# EAGLE schematic Empfangseinheit (EAGLE 8.1.1)
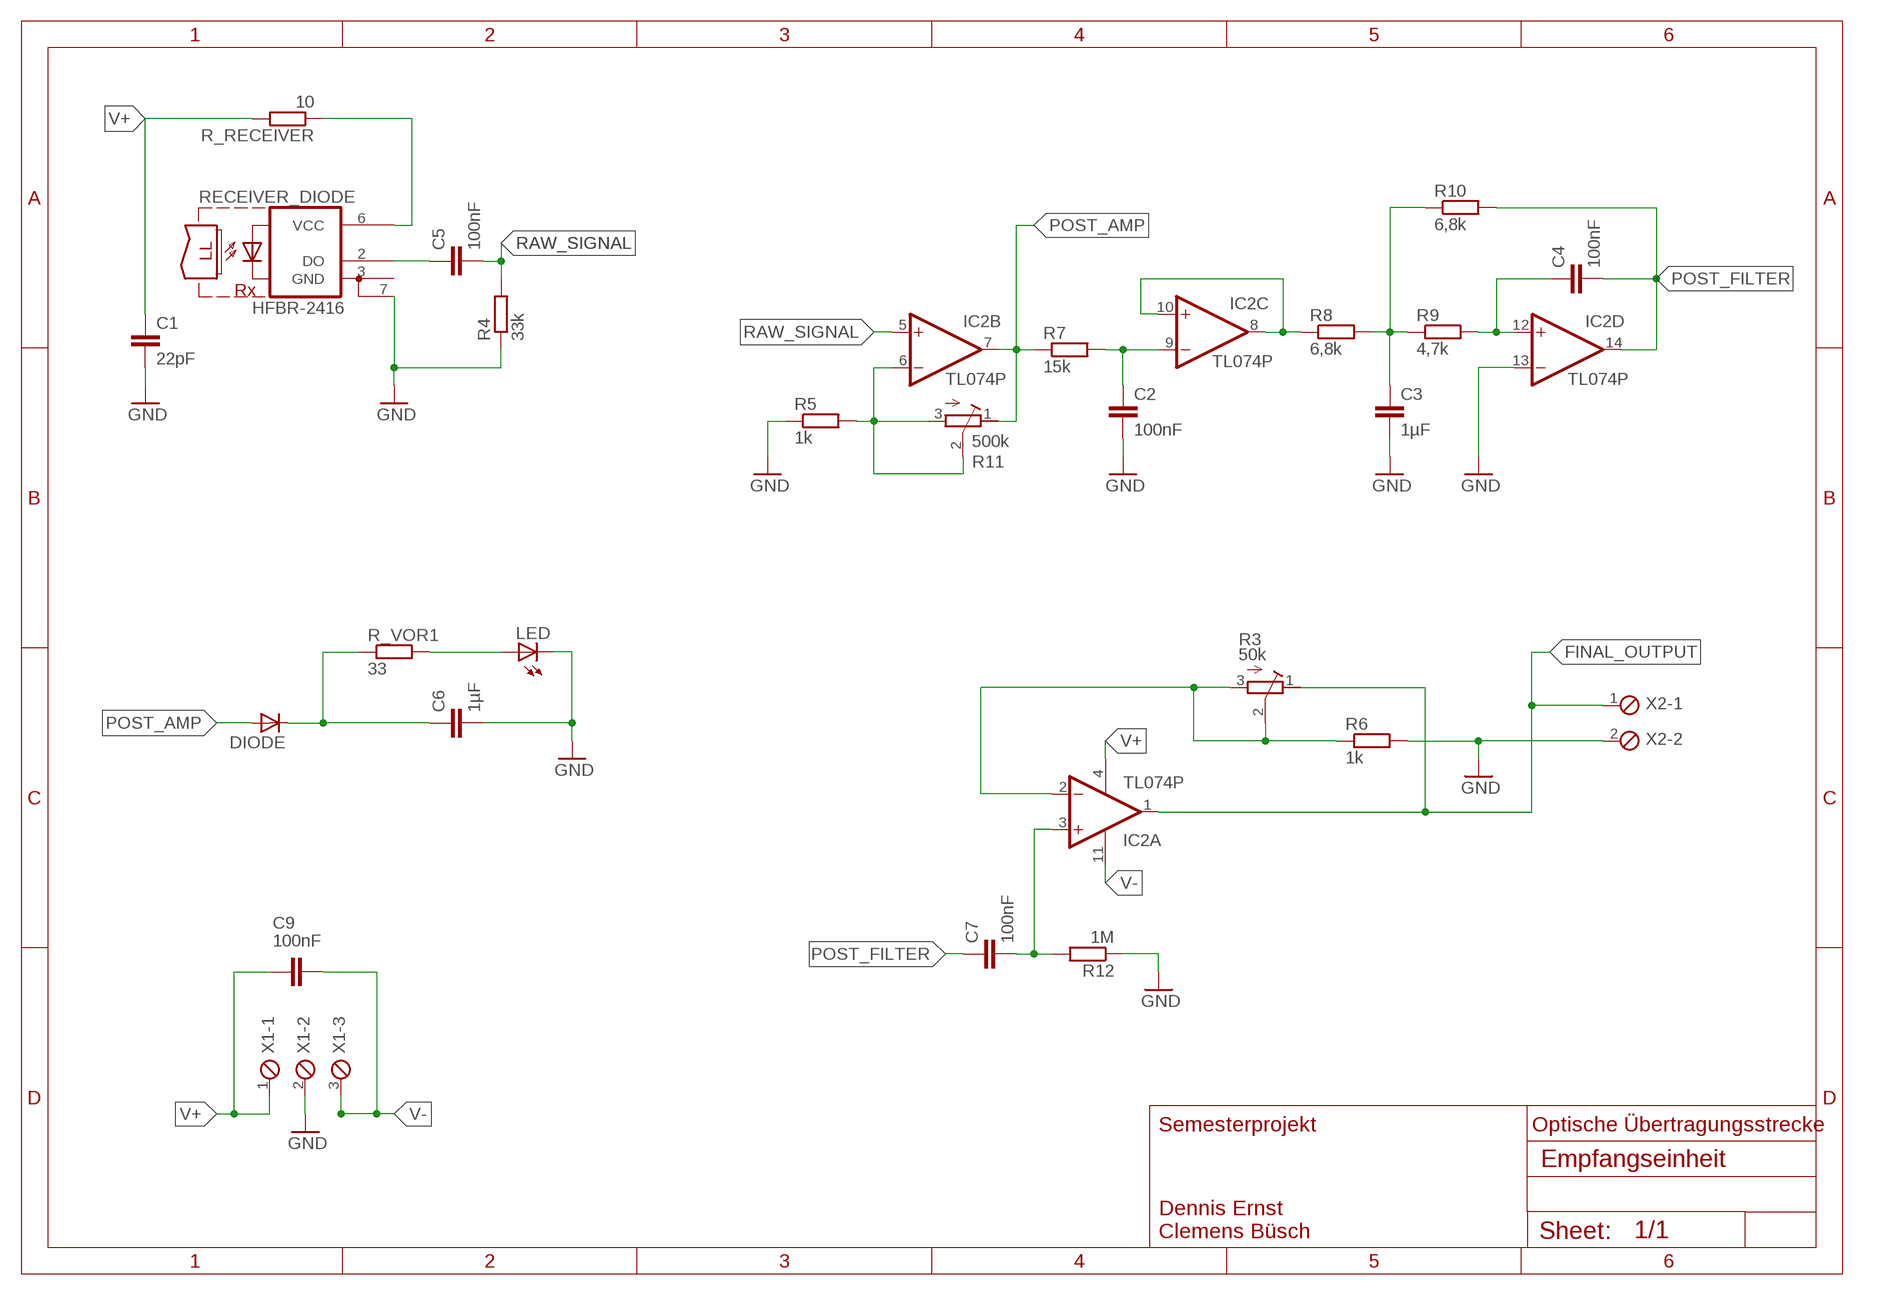
[diagram p0: schematic, sheet 1]

## Parts
C1  22pF  C-EU050-024X044  [C050-024X044]
C2  100nF  C2.5/2  [C2.5-2]
C3  1µF  C7.5/3  [C7.5B3]
C4  100nF  C2.5/2  [C2.5-2]
C5  100nF  C2.5/2  [C2.5-2]
C6  1µF  C2.5/2  [C2.5-2]
C7  100nF  C2.5/2  [C2.5-2]
C9  100nF  C2.5/2  [C2.5-2]
DIODE  DIODE_E-DO35-7  [DIODE_DO35-7]
IC2  TL074P  [DIL14]
LED  LED_ELD260  [LED_LD260]
R3  50k  R-TRIMMT93XA  [RTRIMT93XA]
R4  33k  R-EU_0207_10  [0207/10]
R5  1k  R-EU_0207_10  [0207/10]
R6  1k  R-EU_0207_10  [0207/10]
R7  15k  R-EU_0207_10  [0207/10]
R8  6,8k  R-EU_0207_10  [0207/10]
R9  4,7k  R-EU_0207_10  [0207/10]
R10  6,8k  R-EU_0207_10  [0207/10]
R11  500k  R-TRIMMT93XA  [RTRIMT93XA]
R12  1M  R-EU_0207_10  [0207/10]
R_RECEIVER  10  R-EU_0207_10  [0207/10]
R_VOR1  33  R-EU_0207_10  [0207/10]
RECEIVER_DIODE  HFBR-2416  [HFBR-2416]
X1  MPT3  [3POL254]
X2  MPT2  [2POL254]

## Nets
FINAL_OUTPUT: IC2.1(A:OUT) R3.1(A) X2.1
FINAL_SIGNAL: IC2.2(A:-IN) R3.2(S) R3.3(E) R6.1
GND: C1.2 C2.2 C3.2 C6.2 IC2.13(D:-IN) LED.K(C) R4.1 R5.1 R6.2 R12.1 RECEIVER_DIODE.7(GND1) X1.2 X2.2
N$1: C3.1 R8.2 R9.1 R10.1
N$2: C4.1 IC2.12(D:+IN) R9.2
N$3: C5.1 RECEIVER_DIODE.2(DO)
N$4: IC2.6(B:-IN) R5.2 R11.2(S) R11.3(E)
N$6: C2.1 IC2.9(C:-IN) R7.2
N$7: C7.2 IC2.3(A:+IN) R12.2
N$8: C6.1 DIODE.C(A) R_VOR1.1
N$9: R_RECEIVER.1 RECEIVER_DIODE.6(VCC)
N$11: IC2.8(C:OUT) IC2.10(C:+IN) R8.1
N$13: LED.A R_VOR1.2
POST_AMP: DIODE.A(C) IC2.7(B:OUT) R7.1 R11.1(A)
POST_FILTER: C4.2 C7.1 IC2.14(D:OUT) R10.2
RAW_SIGNAL: C5.2 IC2.5(B:+IN) R4.2
V+: C1.1 C9.2 IC2.4(P:V+) R_RECEIVER.2 X1.1
V-: C9.1 IC2.11(P:V-) X1.3

## Notes on the sheet
- Semesterprojekt | Optische Übertragungsstrecke
- Dennis Ernst
  Clemens Büsch

## Power pins joined to a net without a drawn wire
GND: RECEIVER_DIODE.3(GND)

## Library data of the parts
C1 = rcl:C-EU: CAPACITOR, European symbol
C2-C7 C9 = capacitor-wima:C: CAPACITOR naming: grid - package width
DIODE = eagle-ltspice:DIODE_E-: Schottky Diode; SPICEMODEL: diode; SPICEPREFIX: D
IC2 = linear:TL074: OP AMP
LED = eagle-ltspice:LED_E: LED Source: http://www.osram.convergy.de Source: www.luxeon.com Source: www.kingbright.com; SPICEMODEL: NONE; SPICEPREFIX: D; SPICETYPE: diode
R3 R11 = resistor:R-TRIMM: Trimm resistor
R4-R10 R12 R_RECEIVER R_VOR1 = resistor:R-EU_: RESISTOR, European symbol; SPICEPREFIX: R
RECEIVER_DIODE = RecieverDiode_HFBR2416:HFBR-2416: RECEIVER
X1 = con-phoenix-254:MPT3: PHOENIX CONNECTOR; OC_FARNELL: unknown; OC_NEWARK: unknown
X2 = con-phoenix-254:MPT2: PHOENIX CONNECTOR; OC_FARNELL: unknown; OC_NEWARK: unknown